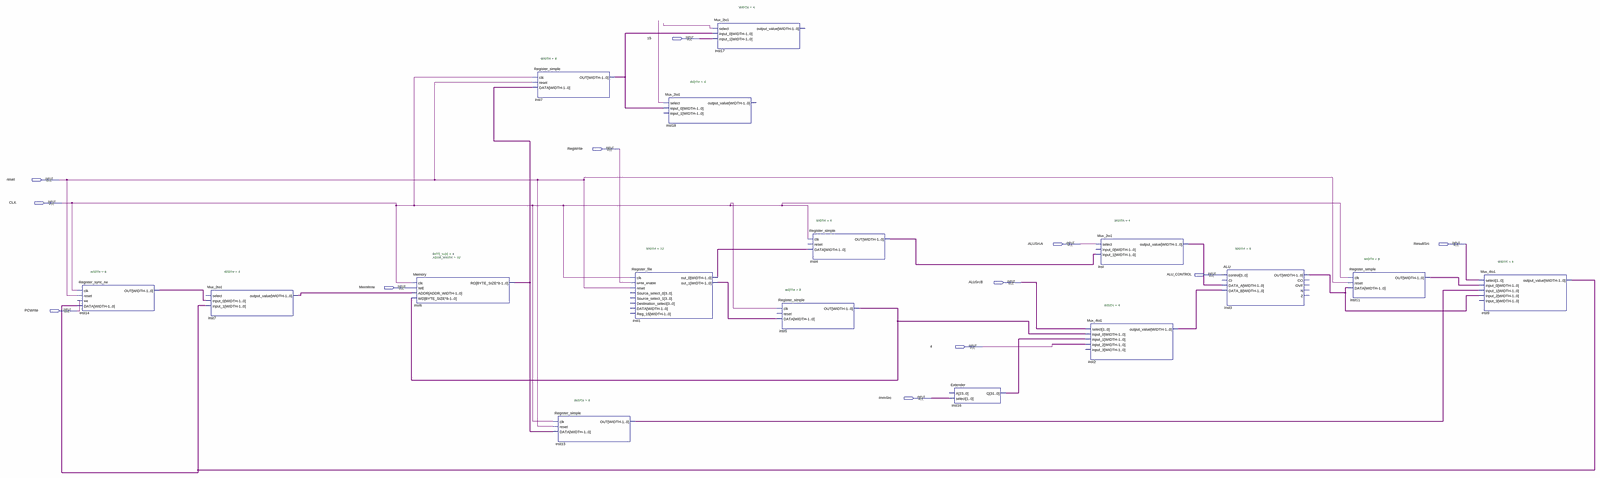
[diagram p0: schematic sheet, whole]
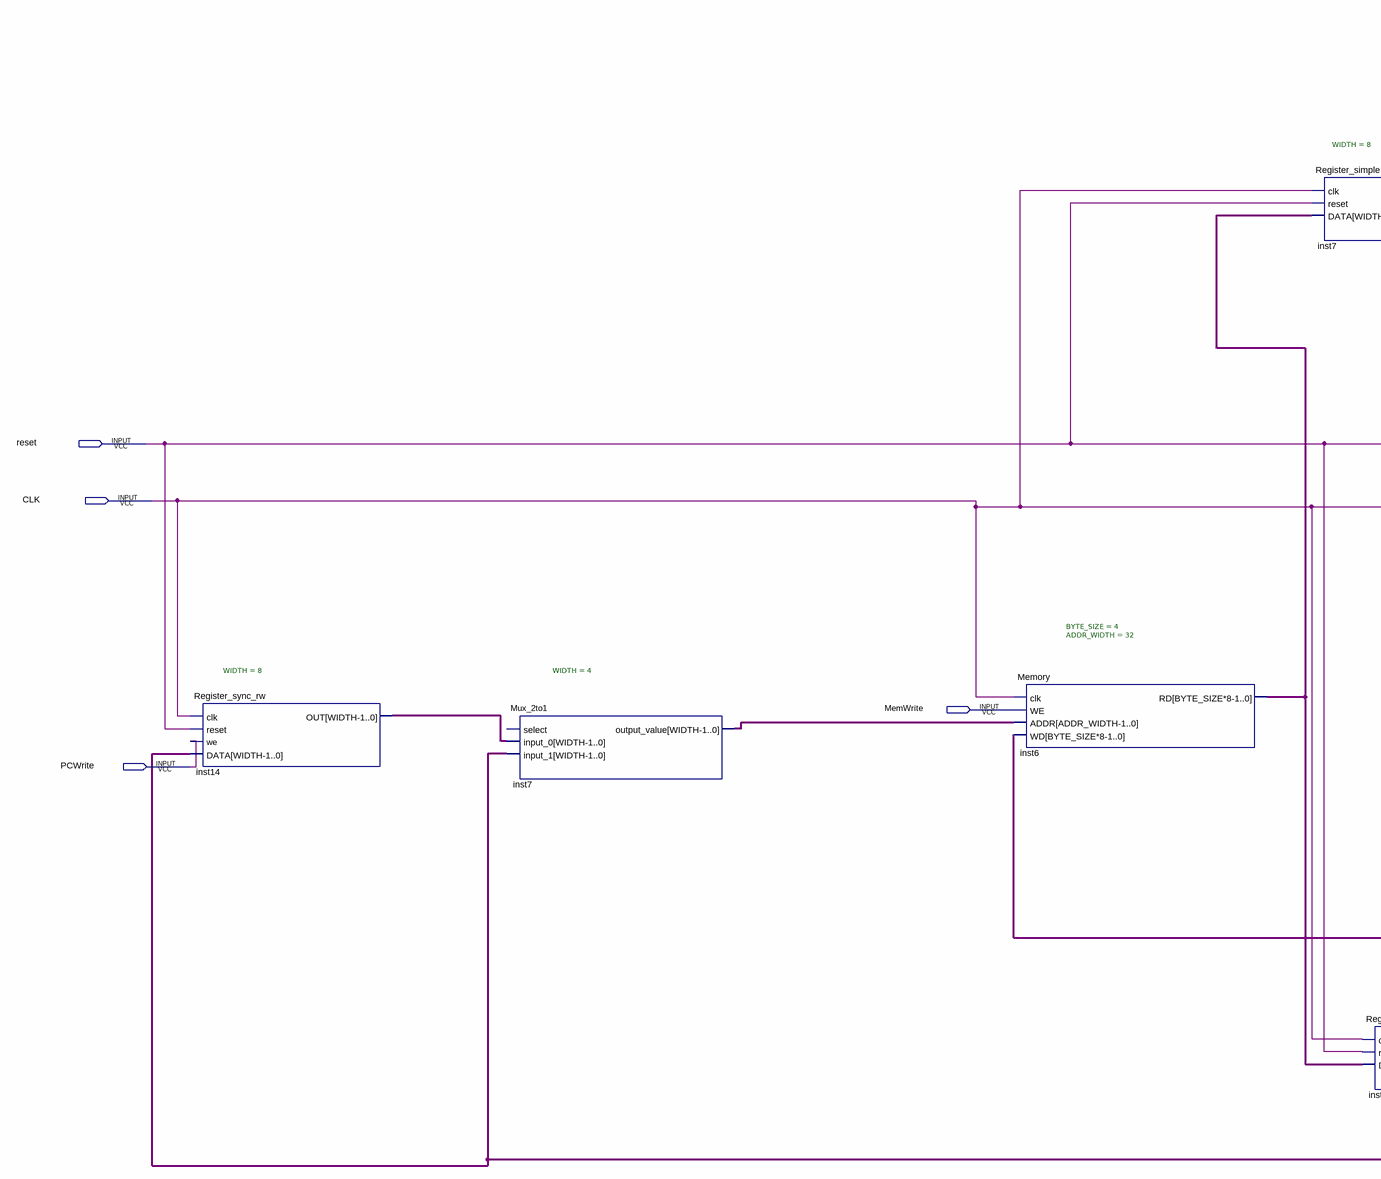
[diagram p1: schematic sheet, left part]
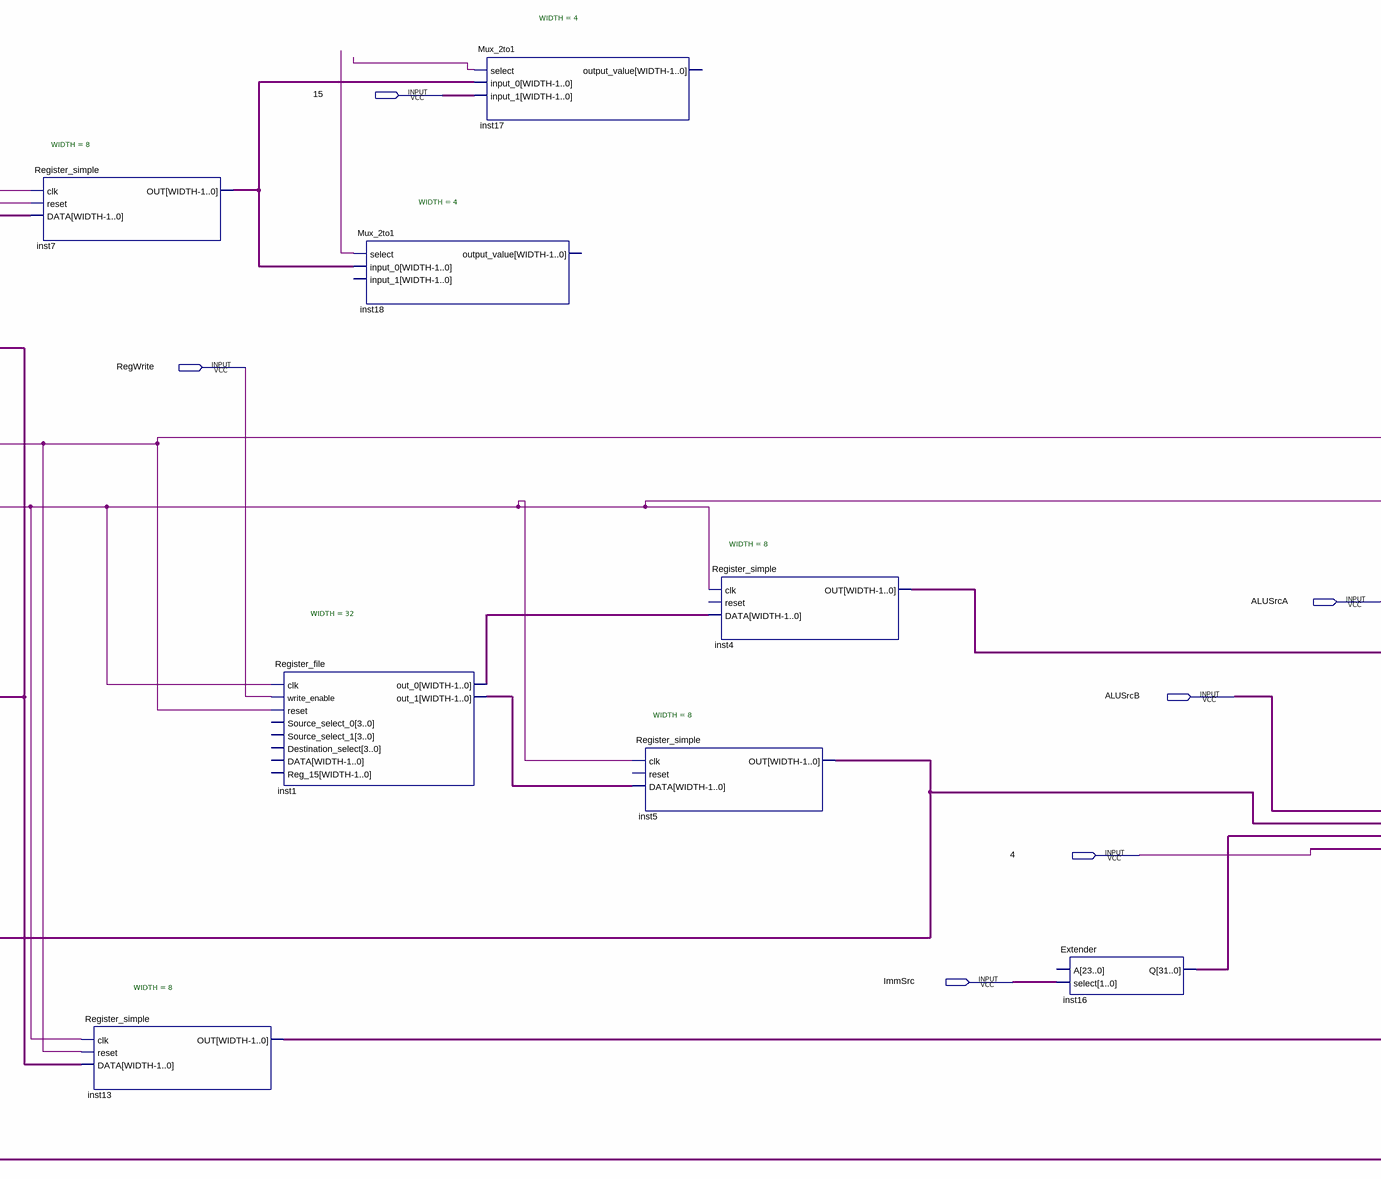
[diagram p2: schematic sheet, centre part]
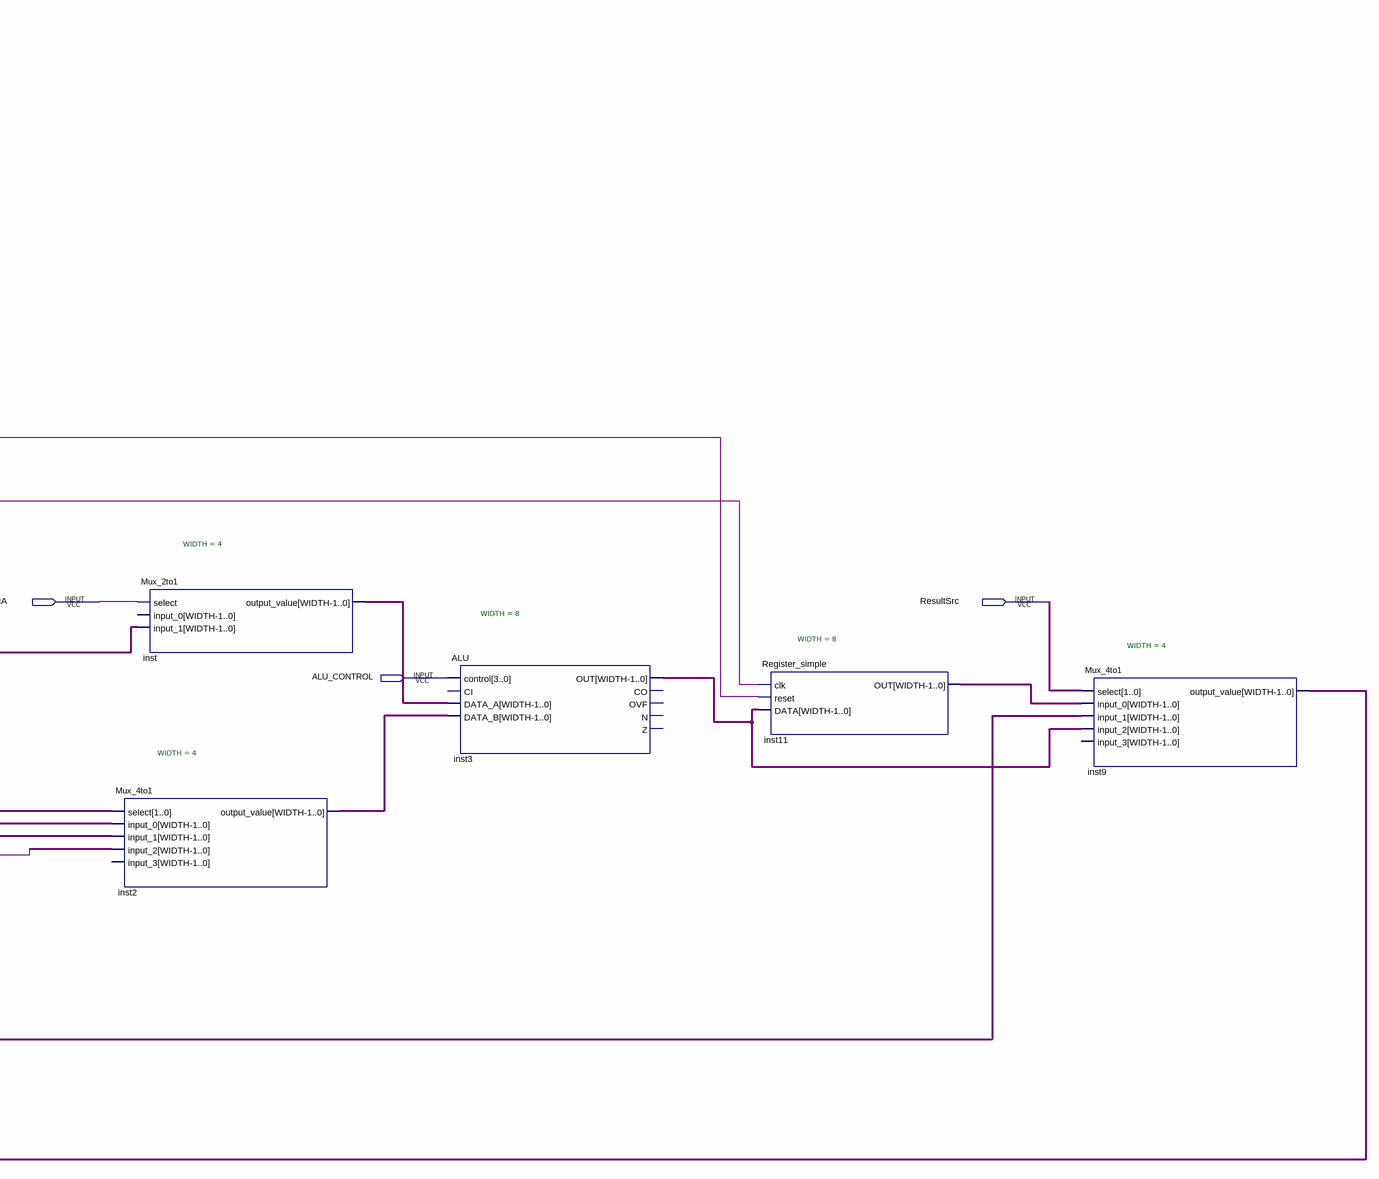
[diagram p3: schematic sheet, right part]
// Quartus schematic datapath_schematic.bdf as structural Verilog: 16 symbols, 12 pins
module datapath_schematic (
  input  \15 ,
  input  RegWrite,
  input  reset,
  input  CLK,
  input  ALUSrcA,
  input  ResultSrc,
  input  ALU_CONTROL,
  input  ALUSrcB,
  input  MemWrite,
  input  PCWrite,
  input  \4 ,
  input  ImmSrc
);

  wire undriven_6, undriven_7;
  wire [1:0] undriven, undriven_3, undriven_4;
  wire [3:0] undriven_2, undriven_5;
  wire [7:0] inst2_output_value, inst3_out, inst4_out, inst7_out, inst9_output_value, inst11_out, inst13_out,
       inst14_out, inst_output_value;
  wire [31:0] inst1_out_0, inst1_out_1, inst5_out, inst6_rd, inst7_output_value, inst16_q;

  Register_sync_rw #(.WIDTH(8)) inst14 (
    .clk(CLK), .reset(reset), .we(PCWrite), .DATA(inst9_output_value), .OUT(inst14_out));
  Mux_2to1 #(.WIDTH(4)) inst7 (
    .input_0(inst14_out), .input_1(inst9_output_value), .output_value(inst7_output_value));  // open: select
  Memory #(.BYTE_SIZE(4), .ADDR_WIDTH(32)) inst6 (
    .clk(CLK), .WE(MemWrite), .ADDR(inst7_output_value), .WD(inst5_out), .RD(inst6_rd));
  Register_simple #(.WIDTH(8)) inst7_dup2 (.clk(CLK), .reset(reset), .DATA(inst6_rd), .OUT(inst7_out));
  Register_simple #(.WIDTH(8)) inst13 (.clk(CLK), .reset(reset), .DATA(inst6_rd), .OUT(inst13_out));
  Register_file #(.WIDTH(32)) inst1 (
    .clk(CLK), .write_enable(RegWrite), .reset(reset), .out_0(inst1_out_0), .out_1(inst1_out_1));  // open: Source_select_0, Source_select_1, Destination_select, DATA, Reg_15
  Mux_2to1 #(.WIDTH(4)) inst18 (.select(undriven_6), .input_0(inst7_out));  // open: input_1, output_value
  Mux_2to1 #(.WIDTH(4)) inst17 (.select(undriven_7), .input_0(inst7_out), .input_1(undriven_5));  // open: output_value
  Register_simple #(.WIDTH(8)) inst5 (.clk(CLK), .DATA(inst1_out_1), .OUT(inst5_out));  // open: reset
  Register_simple #(.WIDTH(8)) inst4 (.clk(CLK), .DATA(inst1_out_0), .OUT(inst4_out));  // open: reset
  Extender inst16 (.select(undriven_4), .Q(inst16_q));  // open: A
  Mux_4to1 #(.WIDTH(4)) inst2 (
    .select(undriven_3), .input_0(inst5_out), .input_1(inst16_q), .input_2(undriven_2),
    .output_value(inst2_output_value));  // open: input_3
  Mux_2to1 #(.WIDTH(4)) inst (
    .select(ALUSrcA), .input_1(inst4_out), .output_value(inst_output_value));  // open: input_0
  ALU #(.WIDTH(8)) inst3 (
    .control({4{ALU_CONTROL}}), .DATA_A(inst_output_value), .DATA_B(inst2_output_value), .OUT(inst3_out));  // open: CI, CO, OVF, N, Z
  Register_simple #(.WIDTH(8)) inst11 (.clk(CLK), .reset(reset), .DATA(inst3_out), .OUT(inst11_out));
  Mux_4to1 #(.WIDTH(4)) inst9 (
    .select(undriven), .input_0(inst11_out), .input_1(inst13_out), .input_2(inst3_out),
    .output_value(inst9_output_value));  // open: input_3
endmodule
